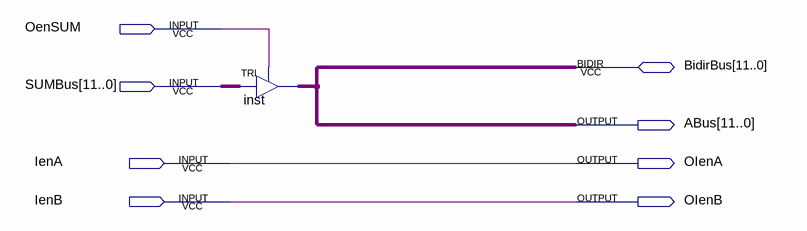
[diagram p0: schematic sheet]
// Quartus schematic contador_UC.bdf as structural Verilog: 1 symbols, 8 pins
module contador_UC (
  input  OenSUM,
  input  [11:0] SUMBus,
  input  IenA,
  input  IenB,
  inout  [11:0] BidirBus,
  output [11:0] ABus,
  output OIenA,
  output OIenB
);

  TRI inst[11:0] (.IN(SUMBus), .OE(OenSUM), .OUT(BidirBus));

  assign ABus = BidirBus;
  assign OIenA = IenA;
  assign OIenB = IenB;
endmodule
